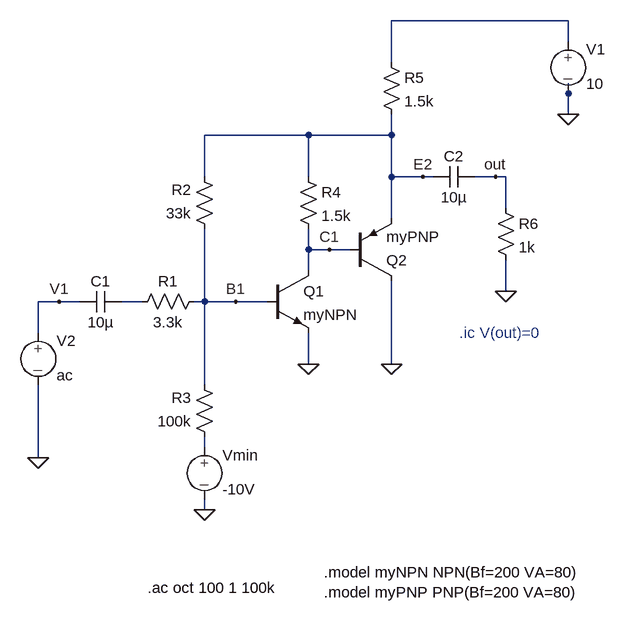
[diagram p0: schematic Klausur_7.1.asc]
Klausur_7.1.asc, the LTspice schematic file:
Version 4
SHEET 1 880 680
WIRE 64 -400 -208 -400
WIRE 64 -368 64 -400
WIRE -208 -336 -208 -400
WIRE 64 -288 64 -304
WIRE 64 -256 64 -288
WIRE -336 -224 -496 -224
WIRE -208 -224 -208 -256
WIRE -208 -224 -336 -224
WIRE -496 -160 -496 -224
WIRE -336 -160 -336 -224
WIRE -208 -160 -208 -224
WIRE -160 -160 -208 -160
WIRE -144 -160 -160 -160
WIRE -48 -160 -80 -160
WIRE -32 -160 -48 -160
WIRE -32 -112 -32 -160
WIRE -208 -96 -208 -160
WIRE -336 -48 -336 -80
WIRE -304 -48 -336 -48
WIRE -272 -48 -304 -48
WIRE -336 -16 -336 -48
WIRE -32 16 -32 -32
WIRE -720 32 -752 32
WIRE -688 32 -720 32
WIRE -592 32 -624 32
WIRE -496 32 -496 -80
WIRE -496 32 -512 32
WIRE -448 32 -496 32
WIRE -400 32 -448 32
WIRE -752 80 -752 32
WIRE -336 128 -336 80
WIRE -208 128 -208 0
WIRE -496 160 -496 32
WIRE -496 256 -496 240
WIRE -752 272 -752 160
WIRE -496 352 -496 336
FLAG -496 352 0
FLAG -336 128 0
FLAG -752 272 0
FLAG -208 128 0
FLAG -32 16 0
FLAG 64 -256 0
FLAG -48 -160 out
FLAG -160 -160 E2
FLAG -304 -48 C1
FLAG -448 32 B1
FLAG -720 32 V1
SYMBOL npn -400 -16 R0
SYMATTR InstName Q1
SYMATTR Value myNPN
SYMBOL res -352 -176 R0
SYMATTR InstName R4
SYMATTR Value 1.5k
SYMBOL res -480 -64 R180
WINDOW 0 36 76 Left 0
WINDOW 3 36 40 Left 0
SYMATTR InstName R2
SYMATTR Value 33k
SYMBOL res -480 256 R180
WINDOW 0 36 76 Left 0
WINDOW 3 36 40 Left 0
SYMATTR InstName R3
SYMATTR Value 100k
SYMBOL pnp -272 0 M180
SYMATTR InstName Q2
SYMATTR Value myPNP
SYMBOL res -496 16 R90
WINDOW 0 0 56 VBottom 0
WINDOW 3 32 56 VTop 0
SYMATTR InstName R1
SYMATTR Value 3.3k
SYMBOL cap -624 16 R90
WINDOW 0 0 32 VBottom 0
WINDOW 3 32 32 VTop 0
SYMATTR InstName C1
SYMATTR Value 10µ
SYMBOL source-V 64 -384 R0
SYMATTR InstName V1
SYMATTR Value 10
SYMBOL source-V -752 64 R0
WINDOW 123 0 0 Left 0
WINDOW 39 0 0 Left 0
SYMATTR InstName V2
SYMATTR Value ac
SYMBOL source-V -496 240 R0
SYMATTR InstName Vmin
SYMATTR Value -10V
SYMBOL res -224 -352 R0
SYMATTR InstName R5
SYMATTR Value 1.5k
SYMBOL cap -80 -176 R90
WINDOW 0 0 32 VBottom 0
WINDOW 3 32 32 VTop 0
SYMATTR InstName C2
SYMATTR Value 10µ
SYMBOL res -48 -128 R0
SYMATTR InstName R6
SYMATTR Value 1k
TEXT -312 448 Left 0 !.model myNPN NPN(Bf=200 VA=80)\n.model myPNP PNP(Bf=200 VA=80)
TEXT -584 472 Left 0 !.ac oct 100 1 100k
TEXT -104 80 Left 0 ;.ic V(out)=0

The netlist it stands for:
* Klausur_7.1.asc
Q1 C1 B1 0 0 myNPN
R4 E2 C1 1.5k
R2 B1 E2 33k
R3 N003 B1 100k
Q2 0 C1 E2 0 myPNP
R1 B1 N002 3.3k
C1 N002 V1 10µ
V1 N001 0 10
V2 V1 0 ac
Vmin N003 0 -10V
R5 N001 E2 1.5k
C2 out E2 10µ
R6 out 0 1k
.model NPN NPN
.model PNP PNP
.lib standard.bjt
.model myNPN NPN(Bf=200 VA=80)
.model myPNP PNP(Bf=200 VA=80)
.ac oct 100 1 100k
* .ic V(out)=0
.backanno
.end